# Altium project PCB_Project_4.PrjPcb
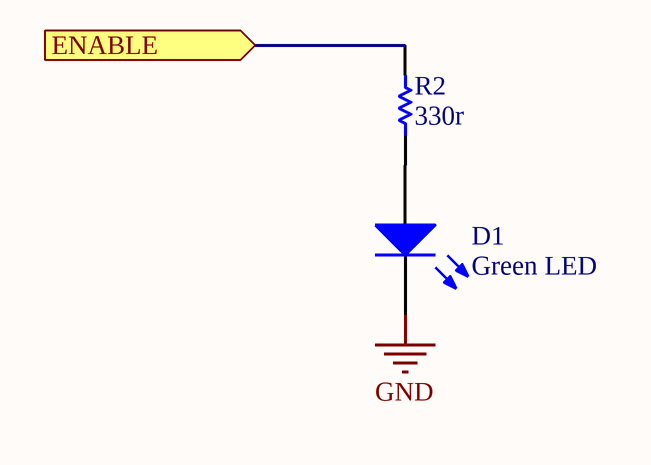
[diagram p0: Sheet1.SchDoc]
2 sheets, 2 parts. Net scope: flat (ports and power ports of the same name join across sheets).
Sheets:
  Sheet1.SchDoc
  Sheet2.SchDoc

## Sheet Sheet1.SchDoc
size A

### Parts
D1  Green LED  [LED-0]
R2  330r  [AXIAL-0.3]

### Ports
ENABLE (in)

### Nets
GND: D1.2(K)
NetD1_1: D1.1(A) R2.1
NetR2_2: R2.2 ; port ENABLE

### Library data of the parts
D1 = LED0: Typical INFRARED GaAs LED; Published: 8-Jun-2000; LatestRevisionDate: 08-Jul-2005; LatestRevisionNote: Mech Layer 1 removed.; PackageReference: LED-0; Publisher: Altium Limited; PackageDescription: LED; 2 Leads
R2 = Res1: Resistor; Value: 1K; Published: 8-Jun-2000; LatestRevisionDate: 17-Jul-2002; LatestRevisionNote: Re-released for DXP Platform.; PackageReference: AXIAL-0.3; Publisher: Altium Limited; PackageDescription: Axial Device, Thru-Hole; 2 Leads; 0.3 in Pin Spacing

## Sheet Sheet2.SchDoc
size A